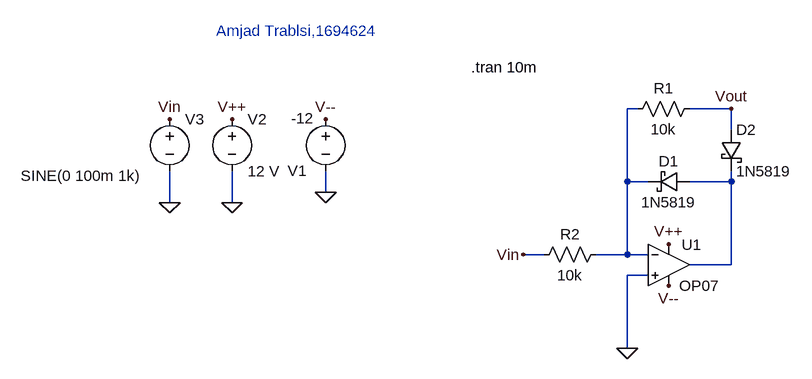
[diagram p0: schematic 1_1_Schotky.asc]
1_1_Schotky.asc, the LTspice schematic file:
Version 4
SHEET 1 880 680
WIRE 608 48 592 48
WIRE 752 48 688 48
WIRE 752 80 752 48
WIRE 592 160 592 48
WIRE 624 160 592 160
WIRE 752 160 752 144
WIRE 752 160 688 160
WIRE 128 176 128 144
WIRE -112 192 -112 144
WIRE -16 192 -16 144
WIRE 464 272 432 272
WIRE 592 272 592 160
WIRE 592 272 544 272
WIRE 624 272 592 272
WIRE 752 288 752 160
WIRE 752 288 688 288
WIRE 624 304 592 304
WIRE 592 416 592 304
FLAG 592 416 0
FLAG -16 192 0
FLAG -112 192 0
FLAG -16 64 V++
FLAG 656 320 V--
FLAG 656 256 V++
FLAG -112 64 Vin
FLAG 432 272 Vin
FLAG 752 48 Vout
FLAG 128 176 0
FLAG 128 64 V--
SYMBOL res 704 32 R90
WINDOW 0 0 56 VBottom 2
WINDOW 3 32 56 VTop 2
SYMATTR InstName R1
SYMATTR Value 10k
SYMBOL schottky 688 144 R90
WINDOW 0 0 32 VBottom 2
WINDOW 3 32 32 VTop 2
SYMATTR InstName D1
SYMATTR Value 1N5819
SYMATTR Description Diode
SYMATTR Type diode
SYMBOL schottky 736 80 R0
SYMATTR InstName D2
SYMATTR Value 1N5819
SYMATTR Description Diode
SYMATTR Type diode
SYMBOL res 560 256 R90
WINDOW 0 0 56 VBottom 2
WINDOW 3 32 56 VTop 2
SYMATTR InstName R2
SYMATTR Value 10k
SYMBOL voltage 128 48 R0
WINDOW 0 -58 95 Left 2
WINDOW 3 -53 14 Left 2
WINDOW 123 0 0 Left 0
WINDOW 39 0 0 Left 0
SYMATTR InstName V1
SYMATTR Value -12
SYMBOL voltage -16 48 R0
WINDOW 123 0 0 Left 0
WINDOW 39 0 0 Left 0
SYMATTR InstName V2
SYMATTR Value 12 V
SYMBOL voltage -112 48 R0
WINDOW 3 -229 103 Left 2
WINDOW 123 0 0 Left 0
WINDOW 39 0 0 Left 0
SYMATTR InstName V3
SYMATTR Value SINE(0 100m 1k)
SYMBOL OpAmps\\OP07 656 224 R0
WINDOW 0 20 33 Left 2
SYMATTR InstName U1
TEXT 352 -16 Left 2 !.tran 10m
TEXT -40 -72 Left 2 ;Amjad Trablsi,1694624

The netlist it stands for:
* 1_1_Schotky.asc
R1 Vout N001 10k
D1 N002 N001 1N5819
D2 Vout N002 1N5819
R2 N001 Vin 10k
V1 V-- 0 -12
V2 V++ 0 12 V
V3 Vin 0 SINE(0 100m 1k)
XU1 0 N001 V++ V-- N002 LT1001  ; OP07, pins In+ In- V+ V- OUT
.model D D
.lib standard.dio
.tran 10m
* Amjad Trablsi,1694624
.lib LTC.lib
.backanno
.end